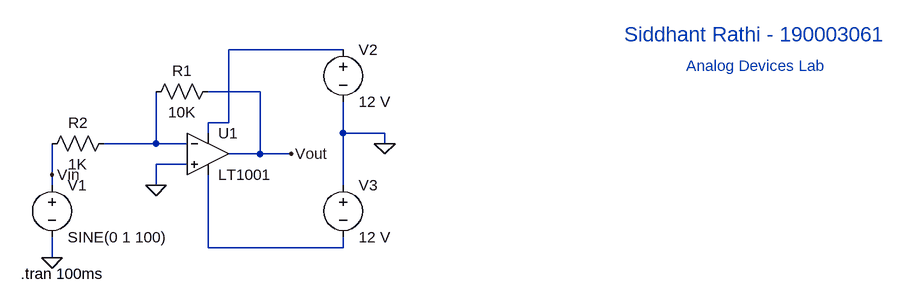
[diagram p0: schematic inverting.asc]
inverting.asc, the LTspice schematic file:
Version 4
SHEET 1 1240 680
WIRE 368 -16 192 -16
WIRE 240 48 160 48
WIRE 192 96 192 -16
WIRE 192 96 160 96
WIRE 160 112 160 96
WIRE 368 112 368 64
WIRE 432 112 368 112
WIRE 80 128 80 48
WIRE 80 128 0 128
WIRE 128 128 80 128
WIRE 432 128 432 112
WIRE 240 144 240 48
WIRE 240 144 192 144
WIRE 288 144 240 144
WIRE 128 160 80 160
WIRE -80 176 -80 128
WIRE -80 192 -80 176
WIRE 80 192 80 160
WIRE 368 192 368 112
WIRE 160 288 160 176
WIRE 368 288 368 272
WIRE 368 288 160 288
WIRE -80 304 -80 272
FLAG 80 192 0
FLAG -80 304 0
FLAG -80 176 Vin
FLAG 288 144 Vout
FLAG 432 128 0
SYMBOL OpAmps\\LT1001 160 80 R0
SYMATTR InstName U1
SYMBOL res 176 32 R90
WINDOW 0 0 56 VBottom 2
WINDOW 3 32 56 VTop 2
SYMATTR InstName R1
SYMATTR Value 10K
SYMBOL res 16 112 R90
WINDOW 0 0 56 VBottom 2
WINDOW 3 32 56 VTop 2
SYMATTR InstName R2
SYMATTR Value 1K
SYMBOL voltage -80 176 R0
WINDOW 123 0 0 Left 0
WINDOW 39 0 0 Left 0
SYMATTR InstName V1
SYMATTR Value SINE(0 1 100)
SYMBOL voltage 368 -32 R0
WINDOW 123 0 0 Left 0
WINDOW 39 0 0 Left 0
SYMATTR InstName V2
SYMATTR Value 12 V
SYMBOL voltage 368 176 R0
WINDOW 123 0 0 Left 0
WINDOW 39 0 0 Left 0
SYMATTR InstName V3
SYMATTR Value 12 V
TEXT -128 328 Left 2 !.tran 100ms
TEXT 800 -40 Left 3 ;Siddhant Rathi - 190003061
TEXT 896 8 Left 2 ;Analog Devices Lab

The netlist it stands for:
* inverting.asc
XU1 0 N002 N001 N003 Vout LT1001  ; pins In+ In- V+ V- OUT
R1 Vout N002 10K
R2 N002 Vin 1K
V1 Vin 0 SINE(0 1 100)
V2 N001 0 12 V
V3 0 N003 12 V
.tran 100ms
* Siddhant Rathi - 190003061
* Analog Devices Lab
.lib LTC.lib
.backanno
.end